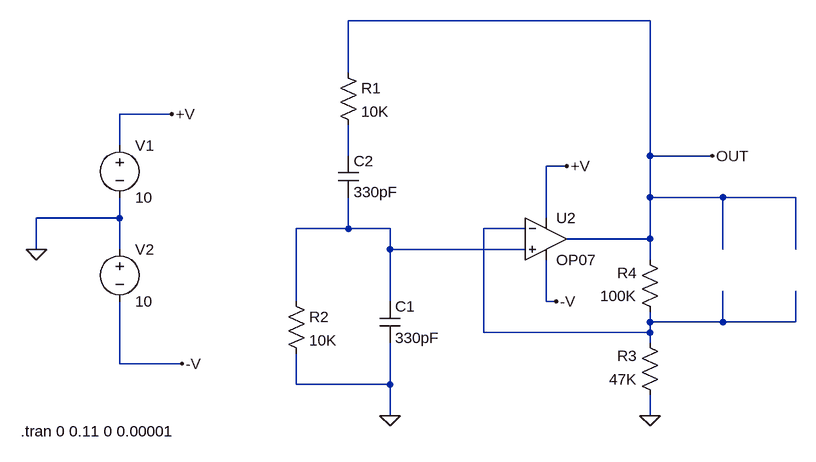
[diagram p0: schematic wein-bridge.asc]
wein-bridge.asc, the LTspice schematic file:
Version 4
SHEET 1 1456 680
WIRE 688 -320 224 -320
WIRE 224 -240 224 -320
WIRE -48 -176 -128 -176
WIRE -128 -128 -128 -176
WIRE 224 -112 224 -160
WIRE 688 -112 688 -320
WIRE 784 -112 688 -112
WIRE 560 -96 528 -96
WIRE 688 -48 688 -112
WIRE 800 -48 688 -48
WIRE 912 -48 800 -48
WIRE -128 -16 -128 -48
WIRE -128 -16 -256 -16
WIRE 528 -16 528 -96
WIRE 224 0 224 -48
WIRE 224 0 144 0
WIRE 288 0 224 0
WIRE 496 0 432 0
WIRE 688 16 688 -48
WIRE 688 16 560 16
WIRE -256 32 -256 -16
WIRE -128 32 -128 -16
WIRE 288 32 288 0
WIRE 496 32 288 32
WIRE 800 32 800 -48
WIRE 912 32 912 -48
WIRE 688 48 688 16
WIRE 144 112 144 0
WIRE 288 112 288 32
WIRE 528 112 528 48
WIRE 544 112 528 112
WIRE 688 144 688 128
WIRE 800 144 800 96
WIRE 800 144 688 144
WIRE 912 144 912 96
WIRE 912 144 800 144
WIRE 432 160 432 0
WIRE 688 160 688 144
WIRE 688 160 432 160
WIRE 688 176 688 160
WIRE -128 208 -128 112
WIRE -32 208 -128 208
WIRE 144 240 144 192
WIRE 288 240 288 176
WIRE 288 240 144 240
WIRE 288 288 288 240
WIRE 688 288 688 256
FLAG 688 288 0
FLAG 288 288 0
FLAG -256 32 0
FLAG -48 -176 +V
FLAG 560 -96 +V
FLAG -32 208 -V
FLAG 544 112 -V
FLAG 784 -112 OUT
SYMBOL res 208 -256 R0
SYMATTR InstName R1
SYMATTR Value 10K
SYMBOL res 128 96 R0
SYMATTR InstName R2
SYMATTR Value 10K
SYMBOL cap 272 112 R0
SYMATTR InstName C1
SYMATTR Value 330pF
SYMBOL cap 208 -112 R0
SYMATTR InstName C2
SYMATTR Value 330pF
SYMBOL res 704 272 R180
WINDOW 0 36 76 Left 2
WINDOW 3 36 40 Left 2
SYMATTR InstName R3
SYMATTR Value 47K
SYMBOL res 704 144 R180
WINDOW 0 36 76 Left 2
WINDOW 3 36 40 Left 2
SYMATTR InstName R4
SYMATTR Value 100K
SYMBOL voltage -128 -144 R0
WINDOW 123 0 0 Left 2
WINDOW 39 0 0 Left 2
SYMATTR InstName V1
SYMATTR Value 10
SYMBOL voltage -128 16 R0
WINDOW 123 0 0 Left 2
WINDOW 39 0 0 Left 2
SYMATTR InstName V2
SYMATTR Value 10
SYMBOL Opamps\\OP07 528 -48 R0
SYMATTR InstName U2
TEXT -280 312 Left 2 !.tran 0 0.11 0 0.00001

The netlist it stands for:
* wein-bridge.asc
R1 OUT N001 10K
R2 N002 0 10K
C1 N002 0 330pF
C2 N001 N002 330pF
R3 0 N003 47K
R4 N003 OUT 100K
V1 +V 0 10
V2 0 -V 10
XU2 N002 N003 +V -V OUT LT1001  ; OP07, pins In+ In- V+ V- OUT
.tran 0 0.11 0 0.00001
.lib LTC.lib
.backanno
.end